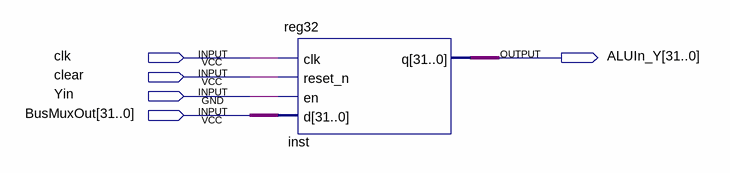
[diagram p0: schematic sheet]
// Quartus schematic y_design.bdf as structural Verilog: 1 symbols, 5 pins
module y_design (
  input  clk,
  input  clear,
  input  Yin,
  input  [31:0] BusMuxOut,
  output [31:0] ALUIn_Y
);

  reg32 inst (.clk(clk), .reset_n(clear), .en(Yin), .d(BusMuxOut), .q(ALUIn_Y));
endmodule
